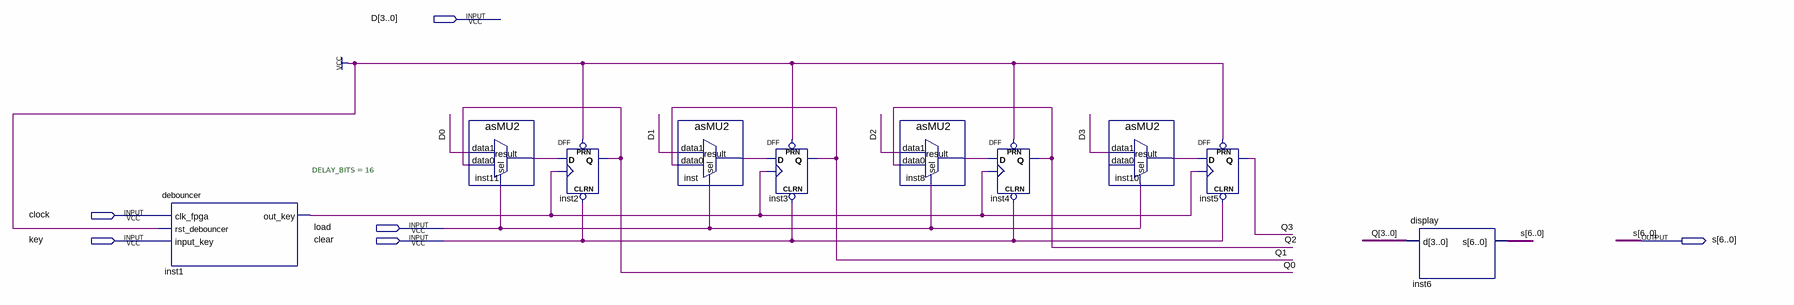
[diagram p0: schematic sheet]
// Quartus schematic registrador.bdf as structural Verilog: 10 symbols, 6 pins
module registrador (
  input  [3:0] D,
  input  clock,
  input  load,
  input  key,
  input  clear,
  output [6:0] s
);

  wire inst1_out_key, inst8_result, inst10_result, inst11_result, inst_result;
  wire [3:0] Q;

  debouncer #(.DELAY_BITS(16)) inst1 (.clk_fpga(clock), .rst_debouncer(1'b1), .input_key(key), .out_key(inst1_out_key));
  asMU2 inst11 (.data1(D[0]), .data0(Q[0]), .sel(load), .result(inst11_result));
  DFF inst2 (.CLRN(clear), .CLK(inst1_out_key), .D(inst11_result), .PRN(1'b1), .Q(Q[0]));
  asMU2 inst (.data1(D[1]), .data0(Q[1]), .sel(load), .result(inst_result));
  DFF inst3 (.CLRN(clear), .CLK(inst1_out_key), .D(inst_result), .PRN(1'b1), .Q(Q[1]));
  asMU2 inst8 (.data1(D[2]), .data0(Q[2]), .sel(load), .result(inst8_result));
  DFF inst4 (.CLRN(clear), .CLK(inst1_out_key), .D(inst8_result), .PRN(1'b1), .Q(Q[2]));
  asMU2 inst10 (.data1(D[3]), .sel(load), .result(inst10_result));  // open: data0
  DFF inst5 (.CLRN(clear), .CLK(inst1_out_key), .D(inst10_result), .PRN(1'b1), .Q(Q[3]));
  display inst6 (.d(Q), .s(s));
endmodule
